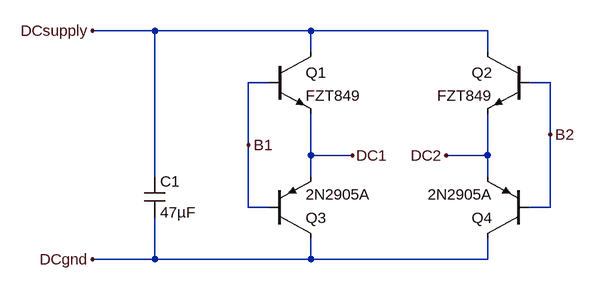
[diagram p0: schematic motor_driver.asc]
motor_driver.asc, the LTspice schematic file:
Version 4
SHEET 1 880 680
WIRE 80 -176 -16 -176
WIRE 320 -176 80 -176
WIRE 592 -176 320 -176
WIRE 320 -144 320 -176
WIRE 592 -144 592 -176
WIRE 256 -96 224 -96
WIRE 688 -96 656 -96
WIRE 688 -16 688 -96
WIRE 224 0 224 -96
WIRE 320 16 320 -48
WIRE 384 16 320 16
WIRE 592 16 592 -48
WIRE 592 16 528 16
WIRE 80 48 80 -176
WIRE 320 48 320 16
WIRE 592 48 592 16
WIRE 224 96 224 0
WIRE 256 96 224 96
WIRE 688 96 688 -16
WIRE 688 96 656 96
WIRE 80 176 80 112
WIRE 80 176 -16 176
WIRE 320 176 320 144
WIRE 320 176 80 176
WIRE 592 176 592 144
WIRE 592 176 320 176
FLAG -16 -176 DCsupply
FLAG -16 176 DCgnd
FLAG 384 16 DC1
FLAG 528 16 DC2
FLAG 224 0 B1
FLAG 688 -16 B2
SYMBOL cap 64 48 R0
SYMATTR InstName C1
SYMATTR Value 47µF
SYMBOL npn 256 -144 R0
SYMATTR InstName Q1
SYMATTR Value FZT849
SYMBOL pnp 656 144 R180
SYMATTR InstName Q4
SYMATTR Value 2N2905A
SYMBOL npn 656 -144 M0
SYMATTR InstName Q2
SYMATTR Value FZT849
SYMBOL pnp 256 144 M180
SYMATTR InstName Q3
SYMATTR Value 2N2905A

The netlist it stands for:
* motor_driver.asc
C1 DCsupply DCgnd 47µF
Q1 DCsupply B1 DC1 0 FZT849
Q4 DCgnd B2 DC2 0 2N2905A
Q2 DCsupply B2 DC2 0 FZT849
Q3 DCgnd B1 DC1 0 2N2905A
.model NPN NPN
.model PNP PNP
.lib standard.bjt
.backanno
.end